# Altium project CANable.PrjPcb
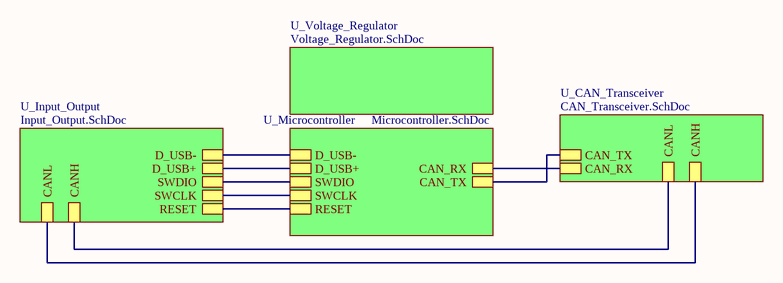
[diagram p0: Master.SchDoc]
5 sheets, 28 parts. Net scope: hierarchical (ports join the sheet entries above them; power ports are global).
Board file: CANable.PcbDoc
Sheets:
  Master.SchDoc
    U_Input_Output = Input_Output.SchDoc
    U_Voltage_Regulator = Voltage_Regulator.SchDoc
    U_Microcontroller = Microcontroller.SchDoc
    U_CAN_Transceiver = CAN_Transceiver.SchDoc

## Sheet Master.SchDoc
size A; SheetNumber: 1; SheetTotal: 5

### Sub-sheets
U_CAN_Transceiver = CAN_Transceiver.SchDoc: CANH, CANL, CAN_TX, CAN_RX
U_Input_Output = Input_Output.SchDoc: D_USB+, D_USB-, CANH, CANL, SWDIO, SWCLK, RESET
U_Microcontroller = Microcontroller.SchDoc: D_USB+, D_USB-, CAN_RX, CAN_TX, SWDIO, SWCLK, RESET
U_Voltage_Regulator = Voltage_Regulator.SchDoc: no entries

### Nets
CANH: sheet U_Input_Output/CANL, sheet U_CAN_Transceiver/CANH
CANL: sheet U_Input_Output/CANH, sheet U_CAN_Transceiver/CANL
D_USB_N: sheet U_Input_Output/D_USB-, sheet U_Microcontroller/D_USB-
D_USB_P: sheet U_Input_Output/D_USB+, sheet U_Microcontroller/D_USB+
RESET: sheet U_Input_Output/RESET, sheet U_Microcontroller/RESET
SWCLK: sheet U_Input_Output/SWCLK, sheet U_Microcontroller/SWCLK
SWDIO: sheet U_Input_Output/SWDIO, sheet U_Microcontroller/SWDIO
NetR5_1: sheet U_Microcontroller/CAN_RX, sheet U_CAN_Transceiver/CAN_RX
NetU1_46: sheet U_Microcontroller/CAN_TX, sheet U_CAN_Transceiver/CAN_TX

## Sheet Input_Output.SchDoc
size A; SheetNumber: 2; SheetTotal: 5
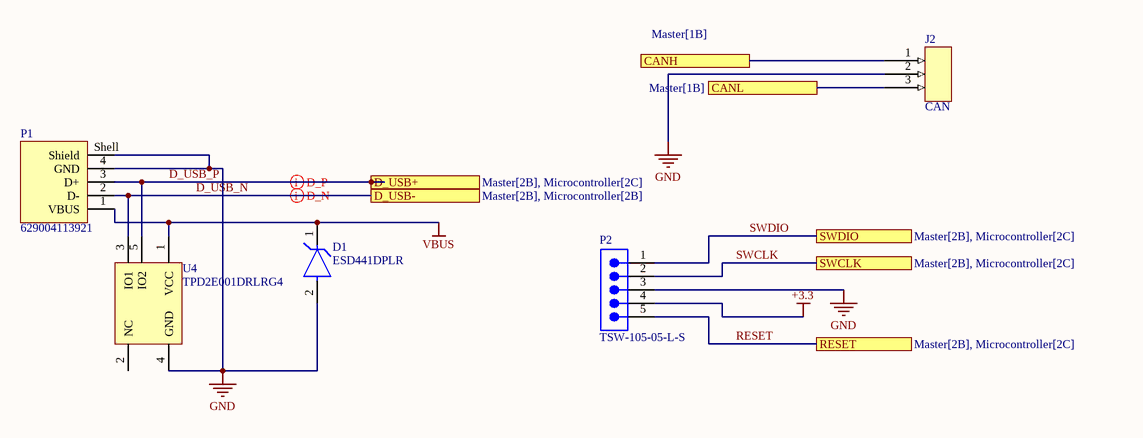
[diagram p1: Input_Output.SchDoc]

### Parts
D1  ESD441DPLR  [FP-DPL0002A-MFG]
J2  CAN  [3 pin 2.54mm header-Footprint-1]
P1  629004113921  [629004113921]
P2  TSW-105-05-L-S  [SMTC-TSW-105-05-X-S]
U4  TPD2E001DRLRG4  [DRL0005A_L]

### Ports
CANH (see Master[1B]), CANL (see Master[1B]), D_USB+ (see Master[2B], Microcontroller[2C]), D_USB- (see Master[2B], Microcontroller[2B]), RESET (see Master[2B], Microcontroller[2C]), SWCLK (see Master[2B], Microcontroller[2C]), SWDIO (see Master[2B], Microcontroller[2C])

### Nets
+3.3: P2.4
GND: D1.2(GND) J2.2 P1.4(GND) P1.Shell(Shield) P2.3 U4.4(GND)
VBUS: D1.1(IO) P1.1(VBUS) U4.1(VCC)
CANH: J2.3 ; port CANL
CANL: J2.1 ; port CANH
D_USB_N: P1.2(D-) U4.3(IO1) ; port D_USB-
D_USB_P: P1.3(D+) U4.5(IO2) ; port D_USB+
RESET: P2.5 ; port RESET
SWCLK: P2.2 ; port SWCLK
SWDIO: P2.1 ; port SWDIO

Not connected (* = marked no-connect by the designer): U4 2(NC)

### Layout directives
differential pair: D_USB_N, D_USB_P

### Library data of the parts
D1 = CMP-00370-140306675-1: ESD441DPLR 1-pF, 5.5-V, 30-KV ESD protection device in 0201 package 2-X2SON -40 to 125; Manufacturer Lifecycle Status: ACTIVE; Number of Channels: 1; Breakdown Voltage: 6V; Capacitance: 1pF; Peak Pulse Current: 6A; Direction: Unidirectional; Peak Pulse Power: 45W; Reverse Standoff Voltage: 5.5V; Clamping Voltage: 3.8V; Lifecycle Status: Production; Length: 600µm; Height: 320µm; Max Operating Temperature: 125°C; Width: 300µm; Number of Pins: 2; Ambient Temperature Range High: 150°C; Min Operating Temperature: -40°C; Thickness: 300µm; NexarPartId: 140306675
J2 = CMP-002-00074-2: 3 pin header for jumpers connectors 2.54mm pitch.
P1 = CMP-1502-03242-2: NexarPartId: 19991169; USB Standard: USB 2.0; Gender: Male; Connector Type: USB; Contact Resistance: 20mΩ; Current Rating: 1.5A; Number of Contacts: 4; Insulation Resistance: 1GΩ; Operating Supply Voltage: 30V; Termination: SMD/SMT; Lead Free: Lead Free; Max Operating Temperature: 105°C; Mount: Horizontal, Surface Mount; Features: Shielded; Orientation: Horizontal; Length: 18.8mm; REACH SVHC: Unknown; Min Operating Temperature: -40°C; Contact Plating: Gold; Number of Pins: 4; RoHS: Compliant
P2 = CMP-1024-00366-1: 0.025" SQ Post Header, Through-hole, Vertical, -55 to 125 degC, 2.54 mm Pitch, 5-Pin, Male, RoHS; Manufacturer: Samtec; Pitch: 2.54 mm; PackageVersion: DM, 8/1988; PartNumber: TSW-105-05-L-S; Orientation: Vertical; Temperature Range: -55 to 125 degC; ComponentLink1Description: Manufacturer URL; PackageDescription: .025[0.64] SQ. Post Terminal Strip Assembly; ComponentLink2URL: http://www.samtec.com/documents/webfiles/pdf/TSW_TH.PDF; PackageReference: TSW-105-05-X-S; ComponentLink2Description: Datasheet; Mounting Technology: Through-hole; DatasheetVersion: F-214; ComponentLink1URL: http://www.samtec.com; RoHS: True; ComponentLink3URL: http://www.samtec.com/documents/webfiles/cpdf/TSW-XXX-XX-XXX-X-XX-XXX-MKT.pdf; ComponentLink3Description: Package Specification
U4 = CMP-0326-00050-2: Low-Capacitance + / - 15 kV ESD-Protection Array for High-Speed Data Interfaces, 2 Channels, -40 to +85 degC, 5-pin SOT (DRL), Green (RoHS & no Sb/Br); Manufacturer: Texas Instruments; USB High Speed: TRUE; IO Leakage Current(nA): 1; IEC 61000-4-2 Contact(+/- kV): 8; Breakdown Voltage(Min)(V): 11; IEC 61000-4-2 Air-Gap(+/- kV): 15; IO Capacitance(Typ)(pF): 1.5; SubFamily: ESD Solution; Eco-Plan: Green (RoHS & no Sb/Br); PackageDescription: 5-Pin Plastic Small Outline, Flat Lead 0.5 mm Pitch; ComponentLink2Description: Datasheet; ComponentLink3URL: SamplesURL:http://www.ti.com/product/tpd2e001#samples; ComponentLink1URL: http://www.ti.com/; PartNumber: TPD2E001DRLRG4; DatasheetVersion: SLLS684F; PackageVersion: revD, Aug-2007; PackageReference: DRL0005A; ComponentLink2URL: http://www.ti.com/general/docs/lit/getliterature.tsp?genericPartNumber=TPD2E001&fileType=pdf; Mounting Technology: Surface Mount; ComponentLink1Description: Manufacturer URL; ComponentLink3Description: URL Link1

## Sheet Voltage_Regulator.SchDoc
size A; SheetNumber: 4; SheetTotal: 5
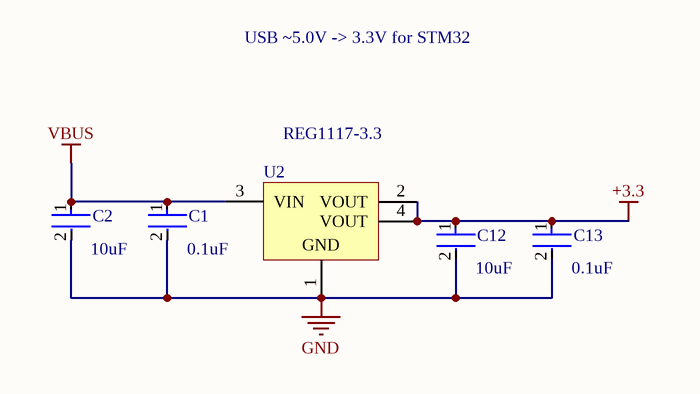
[diagram p2: Voltage_Regulator.SchDoc]

### Parts
C1  0.1uF  [CAPC0603(1608)100_L]
C2  10uF  [CAPC0603(1608)100_L]
C12  10uF  [CAPC0603(1608)100_L]
C13  0.1uF  [CAPC0603(1608)100_L]
U2  REG1117-3.3  [DCY0004A_M]

### Nets
+3.3: C12.1 C13.1 U2.2(VOUT) U2.4(VOUT)
GND: C1.2 C2.2 C12.2 C13.2 U2.1(GND)
VBUS: C1.1 C2.1 U2.3(VIN)

### Notes on the sheet
- USB ~5.0V -> 3.3V for STM32

### Library data of the parts
C1 C2 C12 C13 = CMP-001-00083-4: GENERIC CAPACITOR 0805 or 0603(1608)
U2 = CMP-019-00049-4: LDO Regulator Pos 3.3V 0.8A 4-Pin(3+Tab) SOT-223 Rail

## Sheet Microcontroller.SchDoc
size A; SheetNumber: 3; SheetTotal: 5
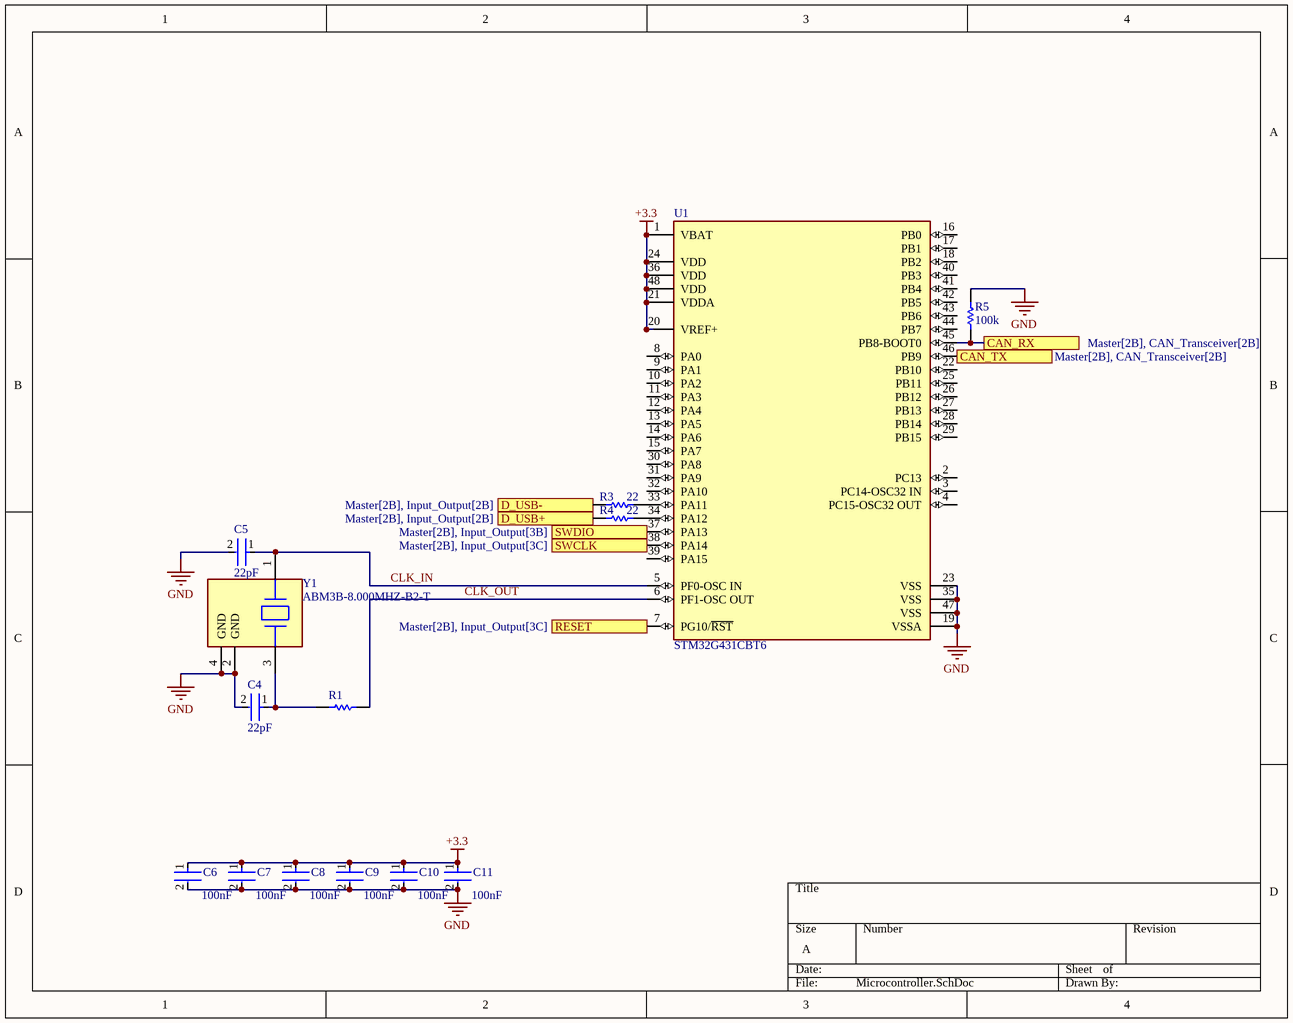
[diagram p3: Microcontroller.SchDoc]

### Parts
C4  22pF  [CAPC0603(1608)100_L]
C5  22pF  [CAPC0603(1608)100_L]
C6  100nF  [CAPC0603(1608)100_L]
C7  100nF  [CAPC0603(1608)100_L]
C8  100nF  [CAPC0603(1608)100_L]
C9  100nF  [CAPC0603(1608)100_L]
C10  100nF  [CAPC0603(1608)100_L]
C11  100nF  [CAPC0603(1608)100_L]
R1  RES 0805  [RESC2013X50X30ML20T20]  (value not drawn)
R3  22  [RESC2013X50X30ML20T20]
R4  22  [RESC2013X50X30ML20T20]
R5  100k  [RESC2013X50X30ML20T20]
U1  STM32G431CBT6  [FP-LQFP48-5B-MFG]
Y1  ABM3B-8.000MHZ-B2-T  [FP-ABM3B-MFG]

### Ports
CAN_RX (see Master[2B], CAN_Transceiver[2B]), CAN_TX (see Master[2B], CAN_Transceiver[2B]), D_USB+ (see Master[2B], Input_Output[2B]), D_USB- (see Master[2B], Input_Output[2B]), RESET (see Master[2B], Input_Output[3C]), SWCLK (see Master[2B], Input_Output[3C]), SWDIO (see Master[2B], Input_Output[3B])

### Nets
+3.3: C6.1 C7.1 C8.1 C9.1 C10.1 C11.1 U1.1(VBAT) U1.20(VREF+) U1.21(VDDA) U1.24(VDD) U1.36(VDD) U1.48(VDD)
GND: C4.2 C5.2 C6.2 C7.2 C8.2 C9.2 C10.2 C11.2 R5.2 U1.19(VSSA) U1.23(VSS) U1.35(VSS) U1.47(VSS) Y1.2(GND) Y1.4(GND)
CLK_IN: C5.1 U1.5(PF0-OSC_IN) Y1.1
CLK_OUT: R1.2 U1.6(PF1-OSC_OUT)
D_USB_N: R3.1 ; port D_USB-
D_USB_P: R4.1 ; port D_USB+
RESET: U1.7(PG10/~{RST}) ; port RESET
SWCLK: U1.38(PA14) ; port SWCLK
SWDIO: U1.37(PA13) ; port SWDIO
NetC4_1: C4.1 R1.1 Y1.3
NetR3_2: R3.2 U1.33(PA11)
NetR4_2: R4.2 U1.34(PA12)
NetR5_1: R5.1 U1.45(PB8-BOOT0) ; port CAN_RX
NetU1_46: U1.46(PB9) ; port CAN_TX

Not connected (* = marked no-connect by the designer): U1 2(PC13) 3(PC14-OSC32_IN) 4(PC15-OSC32_OUT) 8(PA0) 9(PA1) 10(PA2) 11(PA3) 12(PA4) 13(PA5) 14(PA6) 15(PA7) 16(PB0) 17(PB1) 18(PB2) 22(PB10) 25(PB11) 26(PB12) 27(PB13) 28(PB14) 29(PB15) 30(PA8) 31(PA9) 32(PA10) 39(PA15) 40(PB3) 41(PB4) 42(PB5) 43(PB6) 44(PB7)

### Library data of the parts
C4-C11 = CMP-001-00083-4: GENERIC CAPACITOR 0805 or 0603(1608)
R1 R3-R5 = CMP-009-00177-4: Surface Mount 0805 Resistor
U1 = CMP-12105-000030-1: MAINSTREAM ARM CORTEX-M4+ MCU 17; Manufacturer: STMicroelectronics; Number Of Adc Channels: 17; Number Of I/Os: 38; Standoff Height: 0.05mm; Number Of Usb Channels: 1; Data Bus Width: 32bits; Number Of I2C Channels: 3; Number Of Pwm Channels: 31; Frequency: 170MHz; Memory Type: FLASH; Number Of Timers/Counters: 14; Ram Size: 32KBytes; Max Junction Temp: +105°C; Memory Size: 128KBytes; Min Supply Voltage: 1.62V; Max Supply Voltage: 3.6V; Number Of Uart Channels: 4; Interface: I2C,SPI,UART,USART,CAN,USB,LIN,IrDA,I2S; Temperature Range Low: -40°C; Lead Free: Yes; Device Class L3: Microcontrollers; Number Of Cores: 1; Temperature Range High: +85°C; Height: 1.6mm; Digikey Description: MAINSTREAM ARM CORTEX-M4+ MCU 17; Device Class L1: Integrated Circuits (ICs); Package: LQFP48-5B; RoHS: TRUE; Number Of A/D Converters: 1; Core Architecture: Arm Cortex-M4; Device Class L2: Embedded Processors and Controllers; ComponentLink2Description: Datasheet; Temperature: -40°C to +85°C; Ambient Temperature Range High: +85°C; Ambient Temperature Range Low: -40°C; Octopart: https://octopart.com/stm32g431cbt6-stmicroelectronics-98835224; ComponentLink2URL: https://www.st.com/resource/en/datasheet/stm32g431cb.pdf; Automotive: No; Number Of Spi Channels: 3; Manufacturer Part Number: STM32G431CBT6; Category: IC
Y1 = CMP-1688-00002-2: Crystal 8MHz ±20ppm 18pF SMD-4 5mm x 3.2mm; ESR (Equivalent Series Resistance): 200R; Frequency Stability: 50ppm; Operating Frequency: 8 MHz; Mount: Surface Mount; Number of Pins: 4; Packaging: Tape and Reel; Width: 0.126inch; Case/Package: CSMD; Lead Free: Lead Free; Depth: 3.2mm; Load Capacitance: 18pF; Min Operating Temperature: -20°C; Series: ABM3B; Package Quantity: 1000; Resistor Type: Ceramic; Height: 0.043inch; Max Operating Temperature: 70°C; Frequency Tolerance: 20ppm; Series Resistance: 200R; Tolerance: 20ppm; Termination: SMD/SMT; Length: 5mm; Frequency: 8MHz

## Sheet CAN_Transceiver.SchDoc
size A; SheetNumber: 5; SheetTotal: 5; Parameter 1: 120
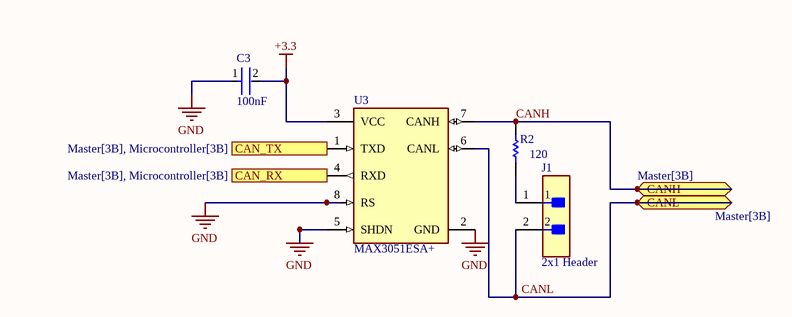
[diagram p4: CAN_Transceiver.SchDoc]

### Parts
C3  100nF  [CAPC0603(1608)100_L]
J1  2x1 Header  [0.1" Header 2x1-Footprint]
R2  120  [RESC2013X50X30ML20T20]
U3  MAX3051ESA+  [FP-S8-4-IPC_B]

### Ports
CAN_RX (see Master[3B], Microcontroller[3B]), CAN_TX (see Master[3B], Microcontroller[3B]), CANH (bidir, see Master[3B]), CANL (bidir, see Master[3B])

### Nets
+3.3: C3.2 U3.3(VCC)
GND: C3.1 U3.2(GND) U3.5(SHDN) U3.8(RS)
CANH: R2.2 U3.7(CANH) ; port CANH
CANL: J1.2 U3.6(CANL) ; port CANL
NetJ1_1: J1.1 R2.1
NetR5_1: U3.4(RXD) ; port CAN_RX
NetU1_46: U3.1(TXD) ; port CAN_TX

### Library data of the parts
C3 = CMP-001-00083-4: GENERIC CAPACITOR 0805 or 0603(1608)
J1 = CMP-002-00002-10: Board Connector, 2 Contact(s), 1 Row(s), Male, Straight, 0.1 inch and 0.079 inch Pitch, Solder Terminal, Locking, Black Insulator; RoHS Compliant: Yes; Connector Type: BOARD CONNECTOR; Mounting Technology: Board
R2 = CMP-009-00177-4: Surface Mount 0805 Resistor
U3 = CMP-015-00014-1: MAX3051 Series 3.3 V 1 Mbps Low-Supply-Current CAN Transceiver - SOIC-8

## Nets that join several sheets
+3.3: Input_Output (P2.4), Voltage_Regulator (C12.1 C13.1 U2.2 U2.4), Microcontroller (12 pins), CAN_Transceiver (C3.2 U3.3)
GND: Input_Output (6 pins), Voltage_Regulator (5 pins), Microcontroller (15 pins), CAN_Transceiver (C3.1 U3.2 U3.5 U3.8)
VBUS: Input_Output (D1.1 P1.1 U4.1), Voltage_Regulator (C1.1 C2.1 U2.3)
CANH: Input_Output (J2.3), CAN_Transceiver (R2.2 U3.7)
CANL: Input_Output (J2.1), CAN_Transceiver (J1.2 U3.6)
D_USB_N: Input_Output (P1.2 U4.3), Microcontroller (R3.1)
D_USB_P: Input_Output (P1.3 U4.5), Microcontroller (R4.1)
NetR5_1: Microcontroller (R5.1 U1.45), CAN_Transceiver (U3.4)
NetU1_46: Microcontroller (U1.46), CAN_Transceiver (U3.1)
RESET: Input_Output (P2.5), Microcontroller (U1.7)
SWCLK: Input_Output (P2.2), Microcontroller (U1.38)
SWDIO: Input_Output (P2.1), Microcontroller (U1.37)